# EasyEDA Pro project 2025_09_11_flash.epro

# Board PCB1
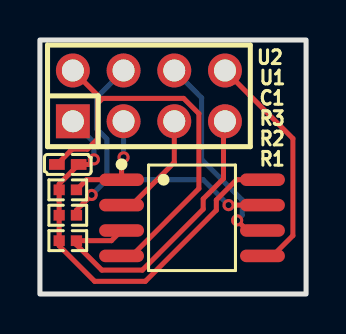
[diagram p0: board, top side]
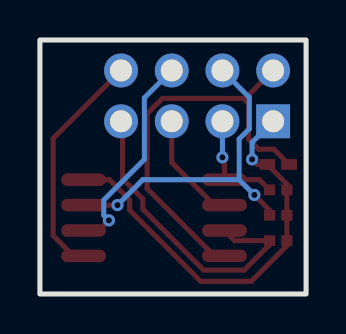
[diagram p1: board, bottom side, seen from below]

Outline 13.34 x 12.7 mm; copper layers: Top Layer, Bottom Layer. Coordinates in mm from the lower left corner of the outline.
Outline path: rectangle 0,12.7 13.34,0
Stack: Top Layer 0.035mm / Dielectric1 1.51mm FR4 er 4.5 / Bottom Layer 0.035mm

## Design rules (mm)
template: JLCPCB Capability(Two Layers Board)
spacing copperThickness1oz (default): track to track 0.102, other pairs 0.152 to 0.3
spacing copperThickness2oz: track to track 0.203, other pairs 0.152 to 0.3
track width copperThickness1oz (default): min 0.127, default 0.254, max 2.54
track width copperThickness2oz: min 0.203, default 0.254, max 2.54
differential pair differentialPair (default): width min 0.127, default 0.254, max 2.54; gap min 0.152, default 0.152
via viaSize (default): diameter min 0.5, default 0.61, max 10; hole min 0.3, default 0.305, max 6.3

## Placement (name value [footprint] x y rotation side)
C1  100nF  [C0402]  1.4 6.48 0 top
R1  10kΩ  [R0402]  1.4 2.67 0 top
R2  10kΩ  [R0402]  1.4 3.94 0 top
R3  10kΩ  [R0402]  1.4 5.21 0 top
U1  W25Q128JVSIQ  [SOIC-8_L5.3-W5.3-P1.27-LS8.0-BL]  7.62 3.81 270 top
U2  ZX-PZ2.54-2-4PZZ  [HDR-TH_8P-P2.54-V-M-R2-C4-S2.54]  5.46 9.91 0 top

## Footprints (pads in the part's own frame, mm; a bottom-side part is the same pattern mirrored in y, then rotated)
C0402
  rect 0.79x0.54 smd: 1(-0.545,0) 2(0.545,0)
HDR-TH_8P-P2.54-V-M-R2-C4-S2.54
  rect 1.7x1.7 hole 1.1: 1(-3.81,-1.27)
  round 1.7 hole 1.1: 2(-3.81,1.27) 3(-1.27,-1.27) 4(-1.27,1.27) 5(1.27,-1.27) 6(1.27,1.27) 7(3.81,-1.27) 8(3.81,1.27)
R0402
  rect 0.566x0.54 smd: 1(-0.433,0) 2(0.433,0)
SOIC-8_L5.3-W5.3-P1.27-LS8.0-BL
  oval 0.63x2.25 smd: 1(-1.905,-3.53) 2(-0.635,-3.53) 3(0.635,-3.53) 4(1.905,-3.53) 5(1.905,3.53) 6(0.635,3.53) 7(-0.635,3.53) 8(-1.905,3.53)

## Nets
GND: C1.1 U1.4 U2.2
VCC: C1.2 R1.1 R2.1 R3.1 U1.8 U2.1
CLK: U1.6 U2.6
CS: R3.2 U1.1 U2.3
DI: U1.5 U2.8
DO: U1.2 U2.5
IO2: R1.2 U1.3 U2.7
IO3: R2.2 U1.7 U2.4

## Via types
v1: diameter 0.61, hole 0.305, Top Layer to Bottom Layer, 5 vias

## Routing (per net, layer and track width the routed paths; a pad name or vN(x,y) marks a point on that pad's centre or on a via; arc(x,y) is an arc through that point)
GND: length 21
  Top Layer w0.254: 2.88,9.53 3.14,9.78 7.2,9.78 7.96,9.02 7.96,5.27 4.6,1.91 U1.4 ; 2.88,9.53 2.88,9.94 U2.2 ; 2.88,9.53 2.88,7.75 2.38,7.24 1.61,7.24 C1.1
VCC: length 21
  Top Layer w0.254: v1(2.7,6.73) 2.45,6.48 C1.2 0.96,5.5 R3.1 R2.1 R1.1 0.96,2.41 2.74,0.64 5.28,0.64 8.84,4.19 8.84,4.7 9.85,5.72 U1.8
  Bottom Layer w0.254: U2.1 2.7,7.58 v1(2.7,6.73)
CLK: length 10.5
  Top Layer w0.254: U1.6 10.39,3.17 v1(9.88,3.68)
  Bottom Layer w0.254: U2.6 8.1,9.81 8.1,6.73 10.13,4.7 10.13,3.94 v1(9.88,3.68)
CS: length 5.4
  Top Layer w0.254: R3.2 2.34,5.72 U1.1 4.09,6.73 v1(4.19,6.83)
  Bottom Layer w0.254: v1(4.19,6.83) U2.3
DI: length 11.6
  Top Layer w0.254: U1.5 11.66,1.91 12.67,2.92 12.67,7.77 U2.8
DO: length 5.6
  Top Layer w0.254: U2.5 6.73,6.58 4.6,4.45 U1.2
IO2: length 15.7
  Top Layer w0.254: U2.7 9.2,8.56 9.2,5.77 8.18,4.75 8.18,4.24 5.13,1.2 3.1,1.2 1.83,2.47 R1.2 3.58,2.67 U1.3
IO3: length 17
  Top Layer w0.254: R2.2 1.83,4.19 v1(2.59,4.95) ; v1(9.45,4.45) U1.7
  Bottom Layer w0.254: 3.35,5.72 8.18,5.72 v1(9.45,4.45) ; 3.35,5.72 v1(2.59,4.95) ; 3.35,5.72 3.35,7.75 2.85,8.26 2.85,9.83 U2.4
